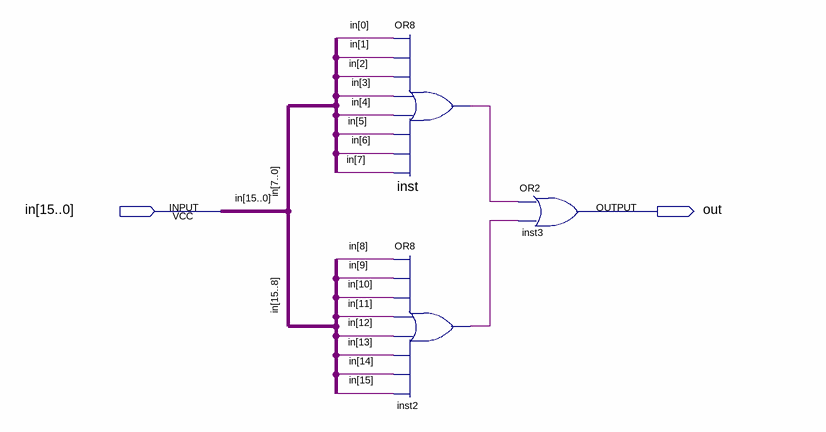
[diagram p0: schematic sheet]
// Quartus schematic 16or.bdf as structural Verilog: 3 symbols, 2 pins
module \16or  (
  input  [15:0] in,
  output out
);

  wire inst2_out, inst_out;

  or inst (inst_out, in[0], in[1], in[2], in[3], in[4], in[5], in[6], in[7]);
  or inst2 (inst2_out, in[8], in[9], in[10], in[11], in[12], in[13], in[14], in[15]);
  or inst3 (out, inst_out, inst2_out);
endmodule
